# EAGLE design D1 - TH LCD Dupont RJ45 (EAGLE 9.5.1)
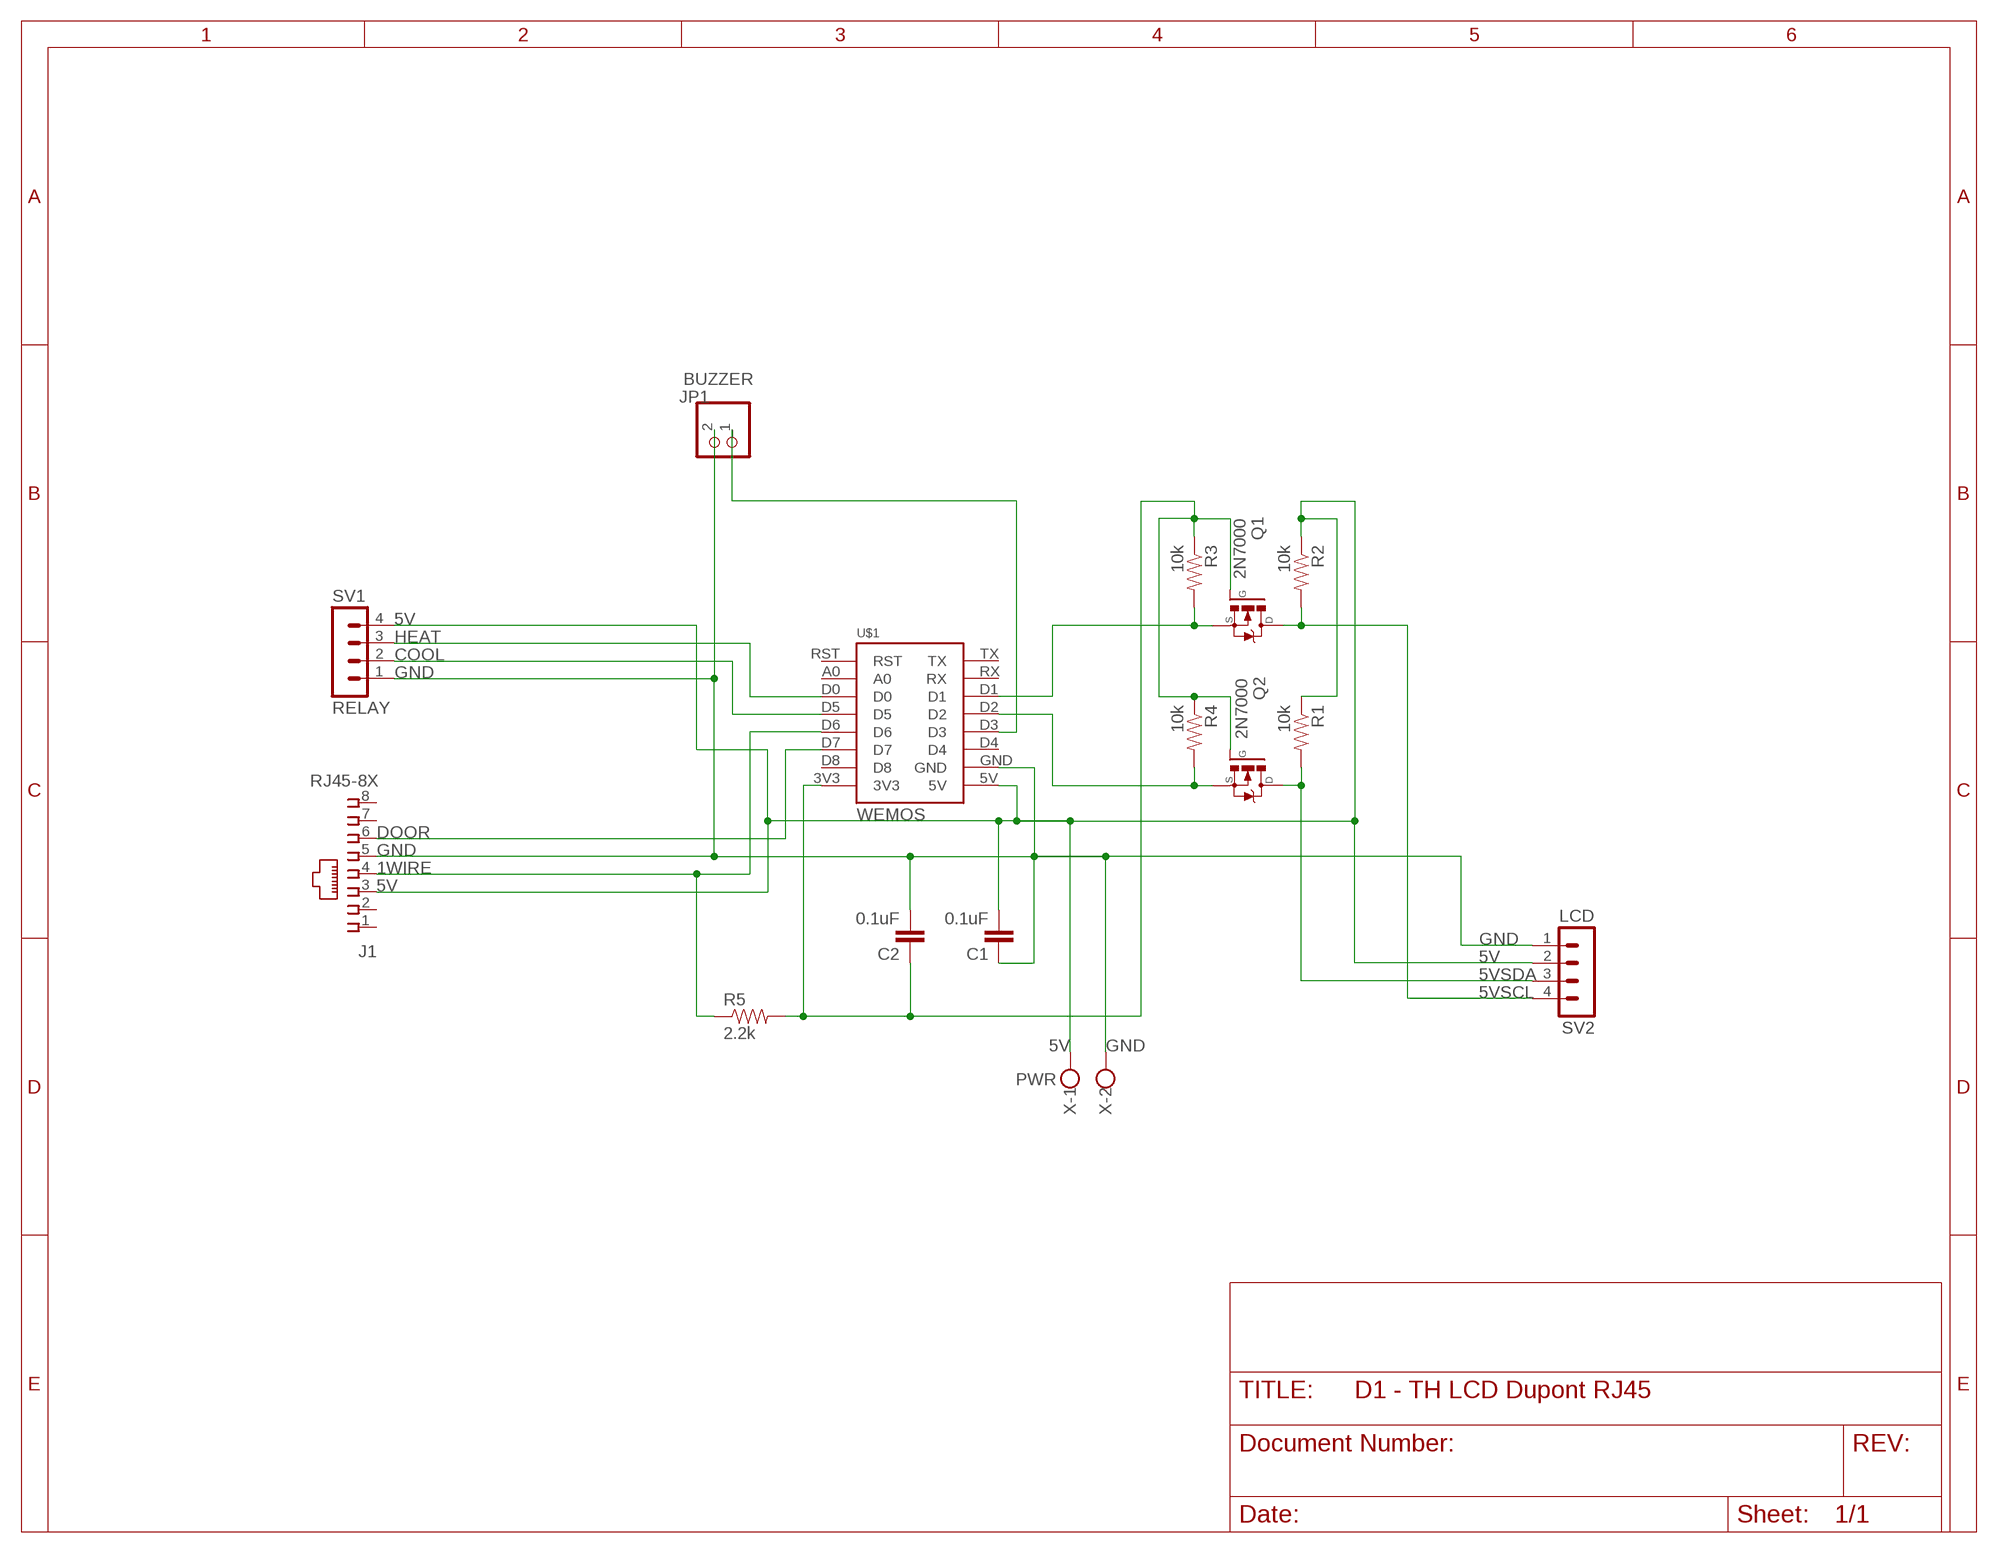
[diagram p0: schematic, sheet 1]

## Parts
BUZZER  JP1  PINHD-1X2  [1X02]
C1  0.1uF  C-EU025-024X044  [C025-024X044]
C2  0.1uF  C-EU025-024X044  [C025-024X044]
J1  RJ45-8X  [RJ45-NO-SHIELD-NOLINE]
Q1  2N7000  [TO-92]
Q2  2N7000  [TO-92]
R1  10k  10KOHM-HORIZ-1/4W-1%  [AXIAL-0.3]
R2  10k  10KOHM-HORIZ-1/4W-1%  [AXIAL-0.3]
R3  10k  10KOHM-HORIZ-1/4W-1%  [AXIAL-0.3]
R4  10k  10KOHM-HORIZ-1/4W-1%  [AXIAL-0.3]
R5  2.2k  10KOHM-HORIZ-1/4W-1%  [AXIAL-0.3]
SV1  RELAY  MA04-1  [MA04-1]
SV2  LCD  MA04-1  [MA04-1]
U$1  WEMOS  [WEMOS]
X  PWR  W237-102  [W237-102]

## Nets
1WIRE: J1.4 R5.P$1 U$1.D6
3V3 [3v]: C2.1 Q1.2(G) Q2.2(G) R3.P$1 R4.P$1 R5.P$2 U$1.3V3
3VSCL: Q1.1(S) R3.P$2 U$1.D1
3VSDA: Q2.1(S) R4.P$2 U$1.D2
5V [5v]: C1.2 J1.3 R1.P$1 R2.P$1 SV1.4 SV2.2 U$1.5V X.1
5VSCL: Q1.3(D) R2.P$2 SV2.4
5VSDA: Q2.3(D) R1.P$2 SV2.3
BZR: BUZZER.1 U$1.D3
COOL: SV1.2 U$1.D5
DOOR: J1.6 U$1.D7
GND [Gnd]: BUZZER.2 C1.1 C2.2 J1.5 SV1.1 SV2.1 U$1.GND X.2
HEAT: SV1.3 U$1.D0
Unconnected: J1.1 J1.2 J1.7 J1.8 U$1.A0 U$1.D4 U$1.D8 U$1.RST U$1.RX U$1.TX

## Library data of the parts
BUZZER = pinhead:PINHD-1X2: PIN HEADER
C1 C2 = rcl:C-EU: CAPACITOR, European symbol; SPICEPREFIX: C
J1 = con-tycoelectronics:RJ45: CORCOM Modular RJ Jacks No Shield Source: www.tycoelectronics.com .. ENG_DS_1654001_1099_RJ_L_0507.pdf; MPN: RJ45-8X; OC_FARNELL: unknown; OC_NEWARK: 16R6101
Q1 Q2 = transistor-fet:2N7000: N-Channel MOSFET
R1-R4 = SparkFun-Resistors:10KOHM: 10kΩ resistor A resistor is a passive two-terminal electrical component that implements electrical resistance as a circuit element. Resistors act to reduce current flow, and, at the same time, act to lower voltage levels within circuits. - Wikipedia; PROD_ID: RES-12183
R5 = SparkFun-Resistors:10KOHM: 10kΩ resistor A resistor is a passive two-terminal electrical component that implements electrical resistance as a circuit element. Resistors act to reduce current flow, and, at the same time, act to lower voltage levels within circuits. - Wikipedia; PROD_ID: RES-12183; VALUE: 10k
SV1 SV2 = con-lstb:MA04-1: PIN HEADER; OC_FARNELL: unknown; OC_NEWARK: unknown
U$1 = 1455413453956-wemos:WEMOS
X = con-wago-500:W237-102: WAGO SCREW CLAMP; MPN: 237-102; OC_FARNELL: unknown; OC_NEWARK: 70K9898

## Net classes
0 default: width 0.305 mm, clearance 0.305 mm
1 5v: width 0.406 mm, clearance 0.406 mm
2 3v: width 0.406 mm, clearance 0.406 mm
3 Gnd: width 0.406 mm, clearance 0.406 mm

## Board
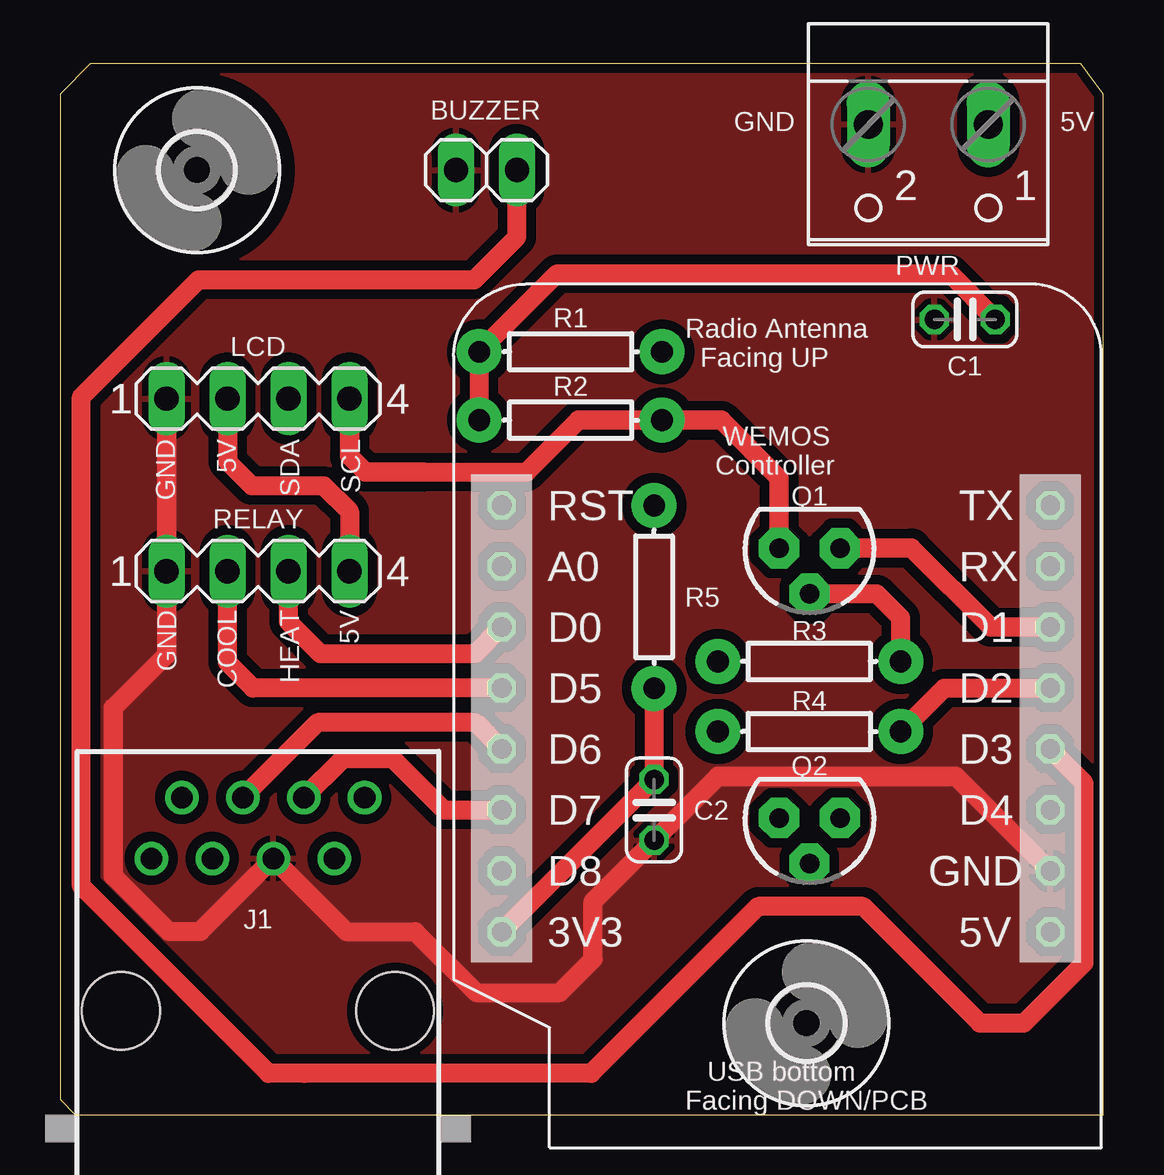
[diagram p1: board, top side]
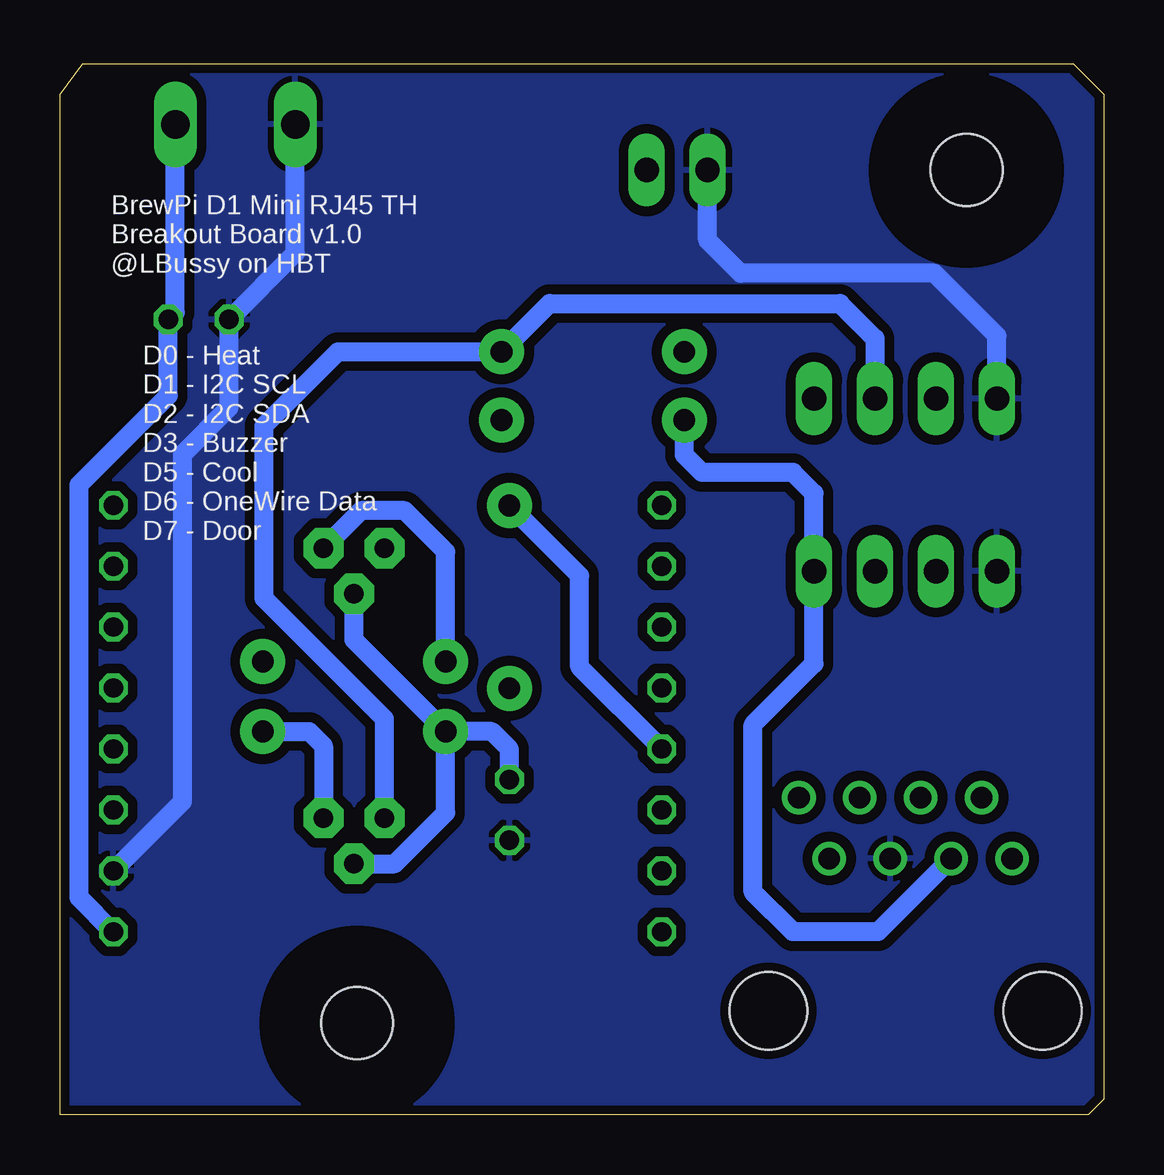
[diagram p2: board, bottom side, seen from below]

Size 43.48 x 43.81 mm. Coordinates in mm from the lower left corner, seen from the top.
Outline: 0,0.63 0.63,0 43.48,0 43.48,42.53 42.54,43.8 41.27,43.81 1.27,43.81 0,42.53 0,0.63
Copper layers 1*16: Top 0.035559375mm / dielectric 1.6mm / Bottom 0.035559375mm
Design rules "oshpark-2layer *": minimum track width 6mil, minimum drill 10mil, track to track 6mil, track to pad 6mil, pad to pad 6mil, via to via 6mil, smd to smd 6mil, copper to edge 15mil, drill to drill 6mil, minimum pad ring 5mil, minimum via ring 5mil, stop-mask expansion 2.5mil, vias tented up to drill 0mil, thermal gap 10mil

### Footprints (pad centres in the part's own frame; a part is rotated, then mirrored left to right if it is on the bottom)
1X02 = drill 1.016 long: 1 -1.27,0; 2 1.27,0
C025-024X044 = drill 0.813 octagon: 1 -1.27,0; 2 1.27,0
RJ45-NO-SHIELD-NOLINE = drill 0.9 pad 1.4: 1 -4.445,6.35; 2 -3.175,8.89; 3 -1.905,6.35; 4 -0.635,8.89; 5 0.635,6.35; 6 1.905,8.89; 7 3.175,6.35; 8 4.445,8.89 | hole 3.251: -5.715,0; 5.715,0
TO-92 = drill 0.813 pad 1.676 octagon: 1 -1.27,0; 2 0,1.905; 3 1.27,0
AXIAL-0.3 = drill 0.9 pad 1.88: P$1 -3.81,0; P$2 3.81,0
MA04-1 = drill 1.016 long: 1 -3.81,0; 2 -1.27,0; 3 1.27,0; 4 3.81,0
WEMOS = drill 0.8 octagon: 3V3 0,0; 5V 22.86,0; A0 0,15.24; D0 0,12.7; D1 22.86,12.7; D2 22.86,10.16; D3 22.86,7.62; D4 22.86,5.08; D5 0,10.16; D6 0,7.62; D7 0,5.08; D8 0,2.54; GND 22.86,2.54; RST 0,17.78; RX 22.86,15.24; TX 22.86,17.78
3,0 = hole 3: 0,0
W237-102 = drill 1.194 long: 1 -2.5,-1.27; 2 2.5,-1.27

### Placement (x,y rotation side)
BUZZER  17.78,39.37 180 top
C1  37.72,33.15 0 top
C2  24.76,12.7 270 top
J1  8.25,4.32 0 top
Q1  31.24,23.61 180 top
Q2  31.24,12.36 180 top
R1  21.29,31.8 0 top
R2  21.29,28.95 0 top
R3  31.24,18.89 180 top
R4  31.24,15.97 0 top
R5  24.76,21.58 270 top
SV1  8.25,22.65 0 top
SV2  8.25,29.85 0 top
U$1  18.41,7.62 0 top
U$2  [3,0]  5.71,39.37 0 top
U$4  [3,0]  31.12,3.81 0 top
X  36.2,40 180 top

### Tracks (layer width: path | path; a pad name or v marks a point on that pad's centre or on a via)
1WIRE
  Top 0.8: J1.4 10.74,16.34 17.31,16.34 U$1.D6
  Bottom 0.8: U$1.D6 21.84,18.67 21.84,22.47 R5.P$1
3V3
  Top 0.8: R3.P$1 35.05,20.71 34.04,21.71 Q1.2 | U$1.3V3 C2.1 R5.P$2
  Bottom 0.8: R4.P$1 31.24,19.79 Q1.2 | Q2.2 29.54,10.46 27.43,12.58 R4.P$1 | C2.1 24.76,15.24 25.49,15.97 R4.P$1
3VSCL
  Top 0.813: Q1.1 35.49,23.62 38.79,20.32 U$1.D1
  Bottom 0.8: R3.P$2 27.43,23.47 29.13,25.17 30.96,25.17 Q1.1
3VSDA
  Top 0.8: R4.P$2 36.86,17.78 U$1.D2
  Bottom 0.8: R4.P$2 33.12,15.97 32.51,15.37 Q2.1
5V
  Top 0.8: R2.P$1 R1.P$1 20.73,35.05 37.08,35.05 C1.2 | SV2.2 6.98,27.23 7.99,26.22 10.99,26.22 12.06,25.15 SV1.4
  Bottom 0.8: U$1.5V 42.7,9.05 42.7,26.26 38.99,29.97 C1.2 38.7,33.44 X.1 | R2.P$1 17.48,27.5 16.74,26.77 12.95,26.77 12.06,25.89 SV1.4 12.06,18.8 14.6,16.26 14.6,9.27 12.95,7.62 9.4,7.62 J1.3
5VSCL
  Top 0.8: 15.13,26.78 19.45,26.78 21.62,28.95
  Top 0.813: SV2.4 12.06,27.45 12.74,26.78 15.13,26.78 | 21.62,28.95 R2.P$2 27.57,28.95 29.97,26.54 Q1.3
5VSDA
  Bottom 0.8: Q2.3 29.97,16.5 34.99,21.52 34.99,28.72 31.91,31.8 R1.P$2 23.09,33.81 10.98,33.81 9.52,32.35 SV2.3
BZR
  Top 0.8: U$1.D3 42.7,13.82 42.7,6.32 40.2,3.82 38.34,3.82 33.48,8.68 29.1,8.68 22.14,1.72 10.2,1.72 8.69,1.72 0.89,9.53 0.89,29.91 1.7,30.72 4.79,33.82 5.77,34.8 9.78,34.8 17.27,34.8 19.05,36.58 BUZZER.1
COOL
  Top 0.8: SV1.2 6.98,18.85 8.05,17.78 U$1.D5
DOOR
  Top 0.8: J1.6 11.78,14.83 13.88,14.83 16.02,12.7 U$1.D7
GND
  Top 0.8: 2.23,9.94 4.53,7.64 5.85,7.64 J1.5 11.94,7.63 14.81,7.63 17.36,5.08 20.83,5.08 22.22,6.48 22.22,8.89 C2.2 | 37.34,14.1 U$1.GND
  Top 0.813: SV2.1 SV1.1 4.45,19.17 2.23,16.95 2.23,9.94 | C2.2 27.43,14.1 37.34,14.1
  Bottom 0.8: U$1.GND 38.39,13.04 38.39,27.52 36.45,29.46 C1.1 33.7,35.9 X.2 | SV2.1 4.45,32.47 7.05,35.07 15.13,35.07 16.51,36.45 BUZZER.2
  pour Top: -1.14,-0.76 44.2,-0.76 44.32,-0.64 44.32,44.2 44.45,44.32 -1.14,44.32
  pour Bottom: 44.32,44.32 44.32,-0.64 44.45,-0.76 -1.02,-0.76 -1.14,44.32
HEAT
  Top 0.8: U$1.D0 17.31,19.22 10.85,19.22 9.52,20.54 SV1.3

### Text on the board
tNames: GND | 5V | GND | 5V | SDA | SCL | GND | COOL | HEAT | 5V
bNames: BrewPi D1 Mini RJ45 TH / Breakout Board v1.0 / @LBussy on HBT | D0 - Heat / D1 - I2C SCL / D2 - I2C SDA / D3 - Buzzer / D5 - Cool / D6 - OneWire Data / D7 - Door